# EAGLE schematic Conversor_R04 (EAGLE 6.6.0)
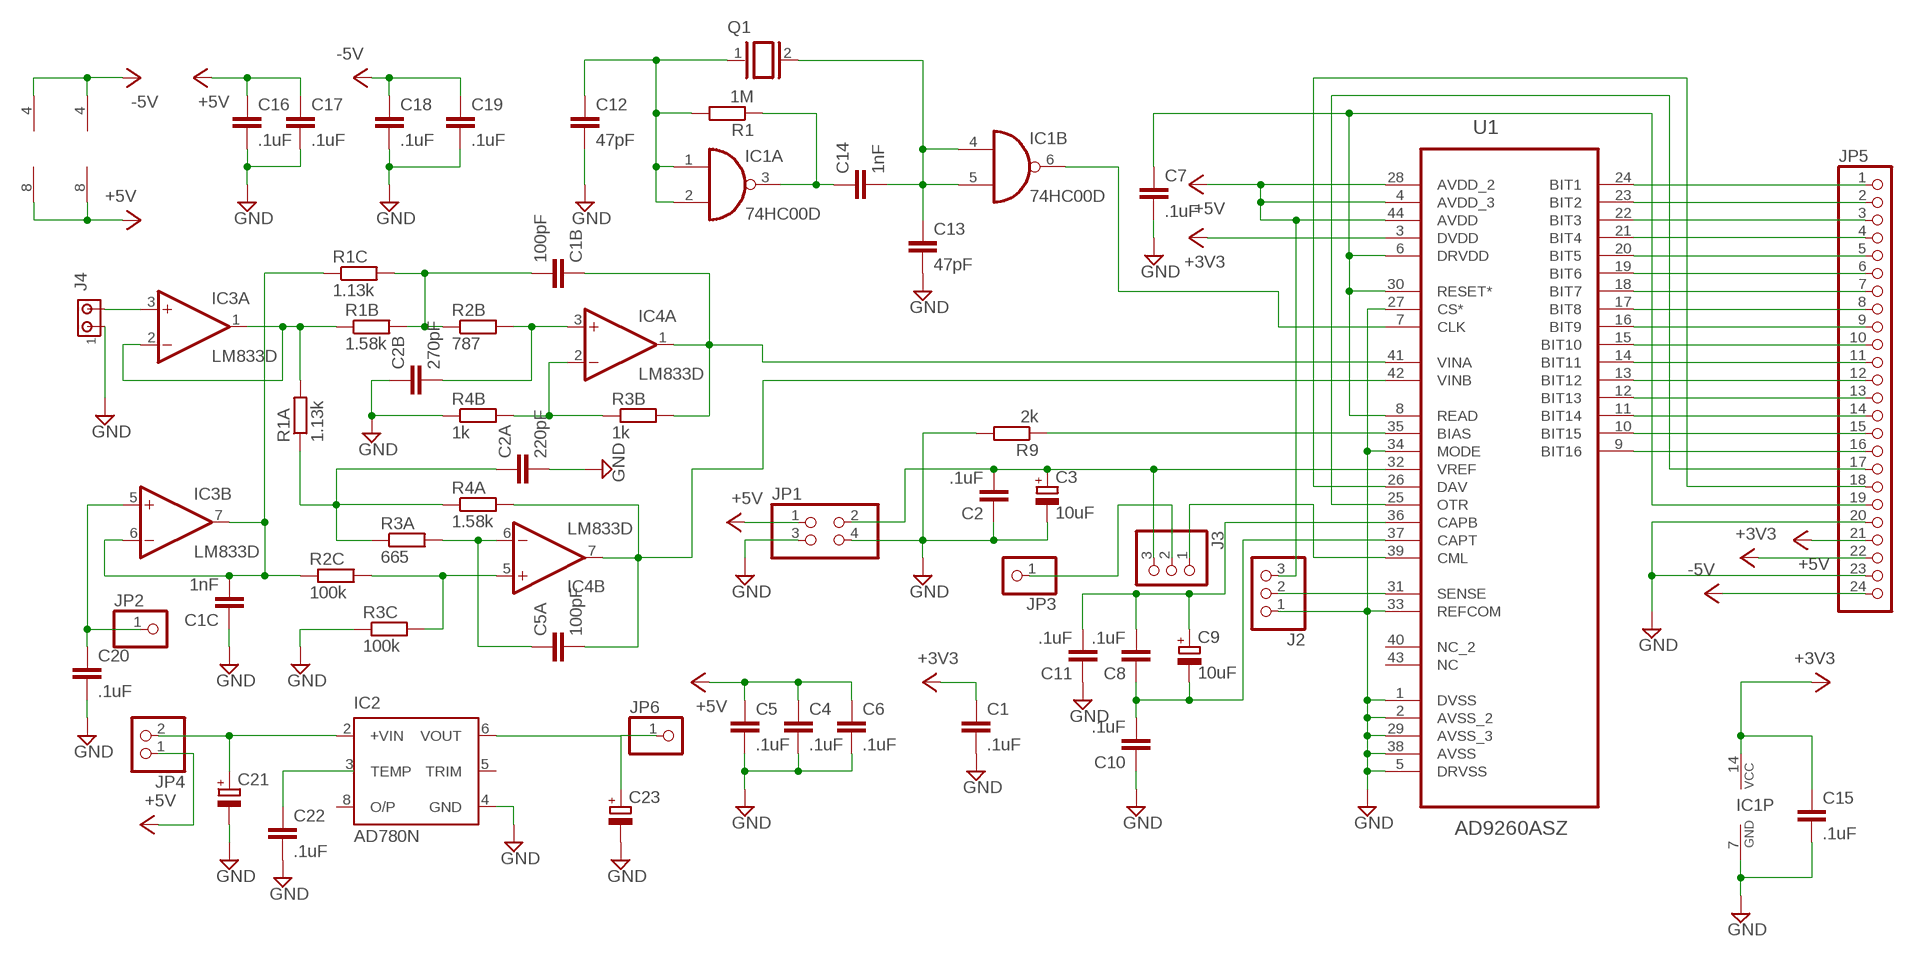
[diagram p0: schematic, sheet 1]

## Parts
C1  .1uF  C-EU050-024X044  [C050-024X044]
C1B  100pF  C-EU025-024X044  [C025-024X044]
C1C  1nF  C-EU025-024X044  [C025-024X044]
C2  .1uF  C-EU050-024X044  [C050-024X044]
C2A  220pF  C-EU050-024X044  [C050-024X044]
C2B  270pF  C-EU025-024X044  [C025-024X044]
C3  10uF  CPOL-EUE2-5  [E2-5]
C4  .1uF  C-EU050-024X044  [C050-024X044]
C5  .1uF  C-EU050-024X044  [C050-024X044]
C5A  100pF  C-EU025-024X044  [C025-024X044]
C6  .1uF  C-EU050-024X044  [C050-024X044]
C7  .1uF  C-EU050-024X044  [C050-024X044]
C8  .1uF  C-EU050-024X044  [C050-024X044]
C9  10uF  CPOL-EUE2-5  [E2-5]
C10  .1uF  C-EU050-024X044  [C050-024X044]
C11  .1uF  C-EU050-024X044  [C050-024X044]
C12  47pF  C-EU025-024X044  [C025-024X044]
C13  47pF  C-EU025-024X044  [C025-024X044]
C14  1nF  C-EU025-024X044  [C025-024X044]
C15  .1uF  C-EU050-024X044  [C050-024X044]
C16  .1uF  C-EU050-024X044  [C050-024X044]
C17  .1uF  C-EU050-024X044  [C050-024X044]
C18  .1uF  C-EU050-024X044  [C050-024X044]
C19  .1uF  C-EU050-024X044  [C050-024X044]
C20  .1uF  C-EU050-024X044  [C050-024X044]
C21  CPOL-EUE2,5-6E  [E2,5-6E]
C22  .1uF  C-EU050-024X044  [C050-024X044]
C23  CPOL-EUE2.5-7  [E2,5-7]
IC1  74HC00D  [SO14]
IC2  AD780N  [DIL08]
IC3  LM833D  [SO08]
IC4  LM833D  [SO08]
J2  PINHD-1X3  [1X03]
J3  PINHD-1X3  [1X03]
J4  MTA02-156  [1X2MTA]
JP1  PINHD-2X2  [2X02]
JP2  PINHD-1X1  [1X01]
JP3  PINHD-1X1  [1X01]
JP4  PINHD-1X2  [1X02]
JP5  PINHD-1X24  [1X24]
JP6  PINHD-1X1  [1X01]
Q1  XTAL/S  [QS]
R1  1M  R-EU_0204/2V  [0204V]
R1A  1.13k  R-EU_0204/7  [0204/7]
R1B  1.58k  R-EU_0204/2V  [0204V]
R1C  1.13k  R-EU_0204/2V  [0204V]
R2B  787  R-EU_0204/2V  [0204V]
R2C  100k  R-EU_0204/7  [0204/7]
R3A  665  R-EU_0204/7  [0204/7]
R3B  1k  R-EU_0204/2V  [0204V]
R3C  100k  R-EU_0204/5  [0204/5]
R4A  1.58k  R-EU_0204/7  [0204/7]
R4B  1k  R-EU_0204/7  [0204/7]
R9  2k  R-EU_0204/2V  [0204V]
U1  AD9260ASZ  [QFP80P1320X1320X245-44N]

## Nets
+3V3: C1.1 C15.1 IC1.14(P:VCC) JP5.22 U1.3(DVDD)
+5V: C4.1 C5.1 C6.1 C16.1 C17.1 IC3.8(P:V+) IC4.8(P:V+) J2.3 JP1.1 JP4.1 JP5.21 U1.4(AVDD_3) U1.28(AVDD_2) U1.44(AVDD)
-5V: C18.1 C19.1 IC3.4(P:V-) IC4.4(P:V-) JP5.24
GND: C1.2 C1C.1 C2.1 C2A.2 C2B.1 C3.- C4.2 C5.2 C6.2 C7.2 C10.1 C11.1 C12.2 C13.2 C15.2 C16.2 C17.2 C18.2 C19.2 C20.2 C21.- C22.2 C23.- IC1.7(P:GND) IC2.4(GND) J2.1 J4.1 JP1.3 JP1.4 JP5.20 JP5.23 R3C.1 R4B.1 R9.2 U1.1(DVSS) U1.2(AVSS_2) U1.5(DRVSS) U1.27(CS*) U1.29(AVSS_3) U1.33(REFCOM) U1.34(MODE) U1.38(AVSS)
N$1: J3.2 JP3.1
N$2: C5A.2 IC4.7(B:OUT) R4A.2 U1.42(VINB)
N$3: J2.2 U1.31(SENSE)
N$5: J3.1 U1.39(CML)
N$6: JP5.1 U1.24(BIT1)
N$7: C21.+ IC2.2(+VIN) JP4.2
N$8: C13.1 C14.2 IC1.4(B:I0) IC1.5(B:I1) Q1.2
N$9: JP5.3 U1.22(BIT3)
N$10: JP5.5 U1.20(BIT5)
N$11: JP5.7 U1.18(BIT7)
N$12: C14.1 IC1.3(A:O) R1.1
N$14: C23.+ IC2.6(VOUT) JP6.1
N$15: C7.1 JP5.19 U1.6(DRVDD) U1.8(READ) U1.30(RESET*)
N$16: JP5.9 U1.16(BIT9)
N$17: JP5.14 U1.11(BIT14)
N$18: IC3.3(A:+IN) J4.2
N$19: C1B.2 R1B.2 R1C.2 R2B.1
N$20: JP5.15 U1.10(BIT15)
N$21: JP5.16 U1.9(BIT16)
N$22: JP5.13 U1.12(BIT13)
N$23: IC4.2(A:-IN) R3B.1 R4B.2
N$24: C5A.1 IC4.6(B:-IN) R3A.2
N$25: JP5.11 U1.14(BIT11)
N$26: IC4.5(B:+IN) R2C.2 R3C.2
N$27: JP5.17 U1.25(OTR)
N$28: JP5.10 U1.15(BIT10)
N$29: C20.1 IC3.5(B:+IN) JP2.1
N$30: C22.1 IC2.3(TEMP)
N$31: JP5.2 U1.23(BIT2)
N$32: C2B.2 IC4.3(A:+IN) R2B.2
N$33: JP5.4 U1.21(BIT4)
N$34: JP5.6 U1.19(BIT6)
N$35: JP5.8 U1.17(BIT8)
N$36: C8.1 C9.- C10.2 U1.37(CAPT)
N$37: C8.2 C9.+ C11.2 U1.36(CAPB)
N$38: JP5.18 U1.26(DAV)
N$39: C1C.2 IC3.6(B:-IN) IC3.7(B:OUT) R1C.1 R2C.1
N$40: C2.2 C3.+ J3.3 JP1.2 U1.32(VREF)
N$41: C2A.1 R1A.1 R3A.1 R4A.1
N$42: IC3.1(A:OUT) IC3.2(A:-IN) R1A.2 R1B.1
N$43: R9.1 U1.35(BIAS)
N$44: JP5.12 U1.13(BIT12)
N$45: IC1.6(B:O) U1.7(CLK)
N$46: C1B.1 IC4.1(A:OUT) R3B.2 U1.41(VINA)
N$47: C12.1 IC1.1(A:I0) IC1.2(A:I1) Q1.1 R1.2
Unconnected: IC1.8(C:O) IC1.9(C:I0) IC1.10(C:I1) IC1.11(D:O) IC1.12(D:I0) IC1.13(D:I1) IC2.5(TRIM) IC2.8(O/P) U1.40(NC_2) U1.43(NC)

## Library data of the parts
C1 C1B C1C C2 C2A C2B C4 C5 C5A C6-C8 C10-C20 C22 = rcl:C-EU: CAPACITOR, European symbol
C3 C9 C21 C23 = rcl:CPOL-EU: POLARIZED CAPACITOR, European symbol
IC1 = 74xx-eu:74*00: Quad 2-input NAND gate
IC2 = analog-devices:AD780: High Precision Reference 2.5V/3.0V Source: http://www.analog.com/UploadedFiles/Data_Sheets/AD780.pdf; MF: ALTERA CORPORATION; MPN: AD780ANZ; OC_FARNELL: 9605550; OC_NEWARK: 59K5478
IC3 IC4 = linear:LM833: OP AMP
J2 J3 = pinhead:PINHD-1X3: PIN HEADER
J4 = con-amp:MTA02-156: AMP connector
JP1 = pinhead:PINHD-2X2: PIN HEADER
JP2 JP3 JP6 = pinhead:PINHD-1X1: PIN HEADER
JP4 = pinhead:PINHD-1X2: PIN HEADER
JP5 = pinhead:PINHD-1X24: PIN HEADER
Q1 = special:XTAL/S: CRYSTAL
R1 R1A R1B R1C R2B R2C R3A R3B R3C R4A R4B R9 = rcl:R-EU_: RESISTOR, European symbol
U1 = ADI-Phase-2:AD9260ASZ: High Speed Oversampling CMOS Analog-to-Digital Converters; MPN: AD9260ASZ; OC_FARNELL: unknown; OC_NEWARK: 59K7245; PACKAGE: QFP-44; SUPPLIER: Analog Devices

## Net classes
0 default: clearance 0.205 mm